# EAGLE design KeypadDisplay rev A (EAGLE 9.4.2)
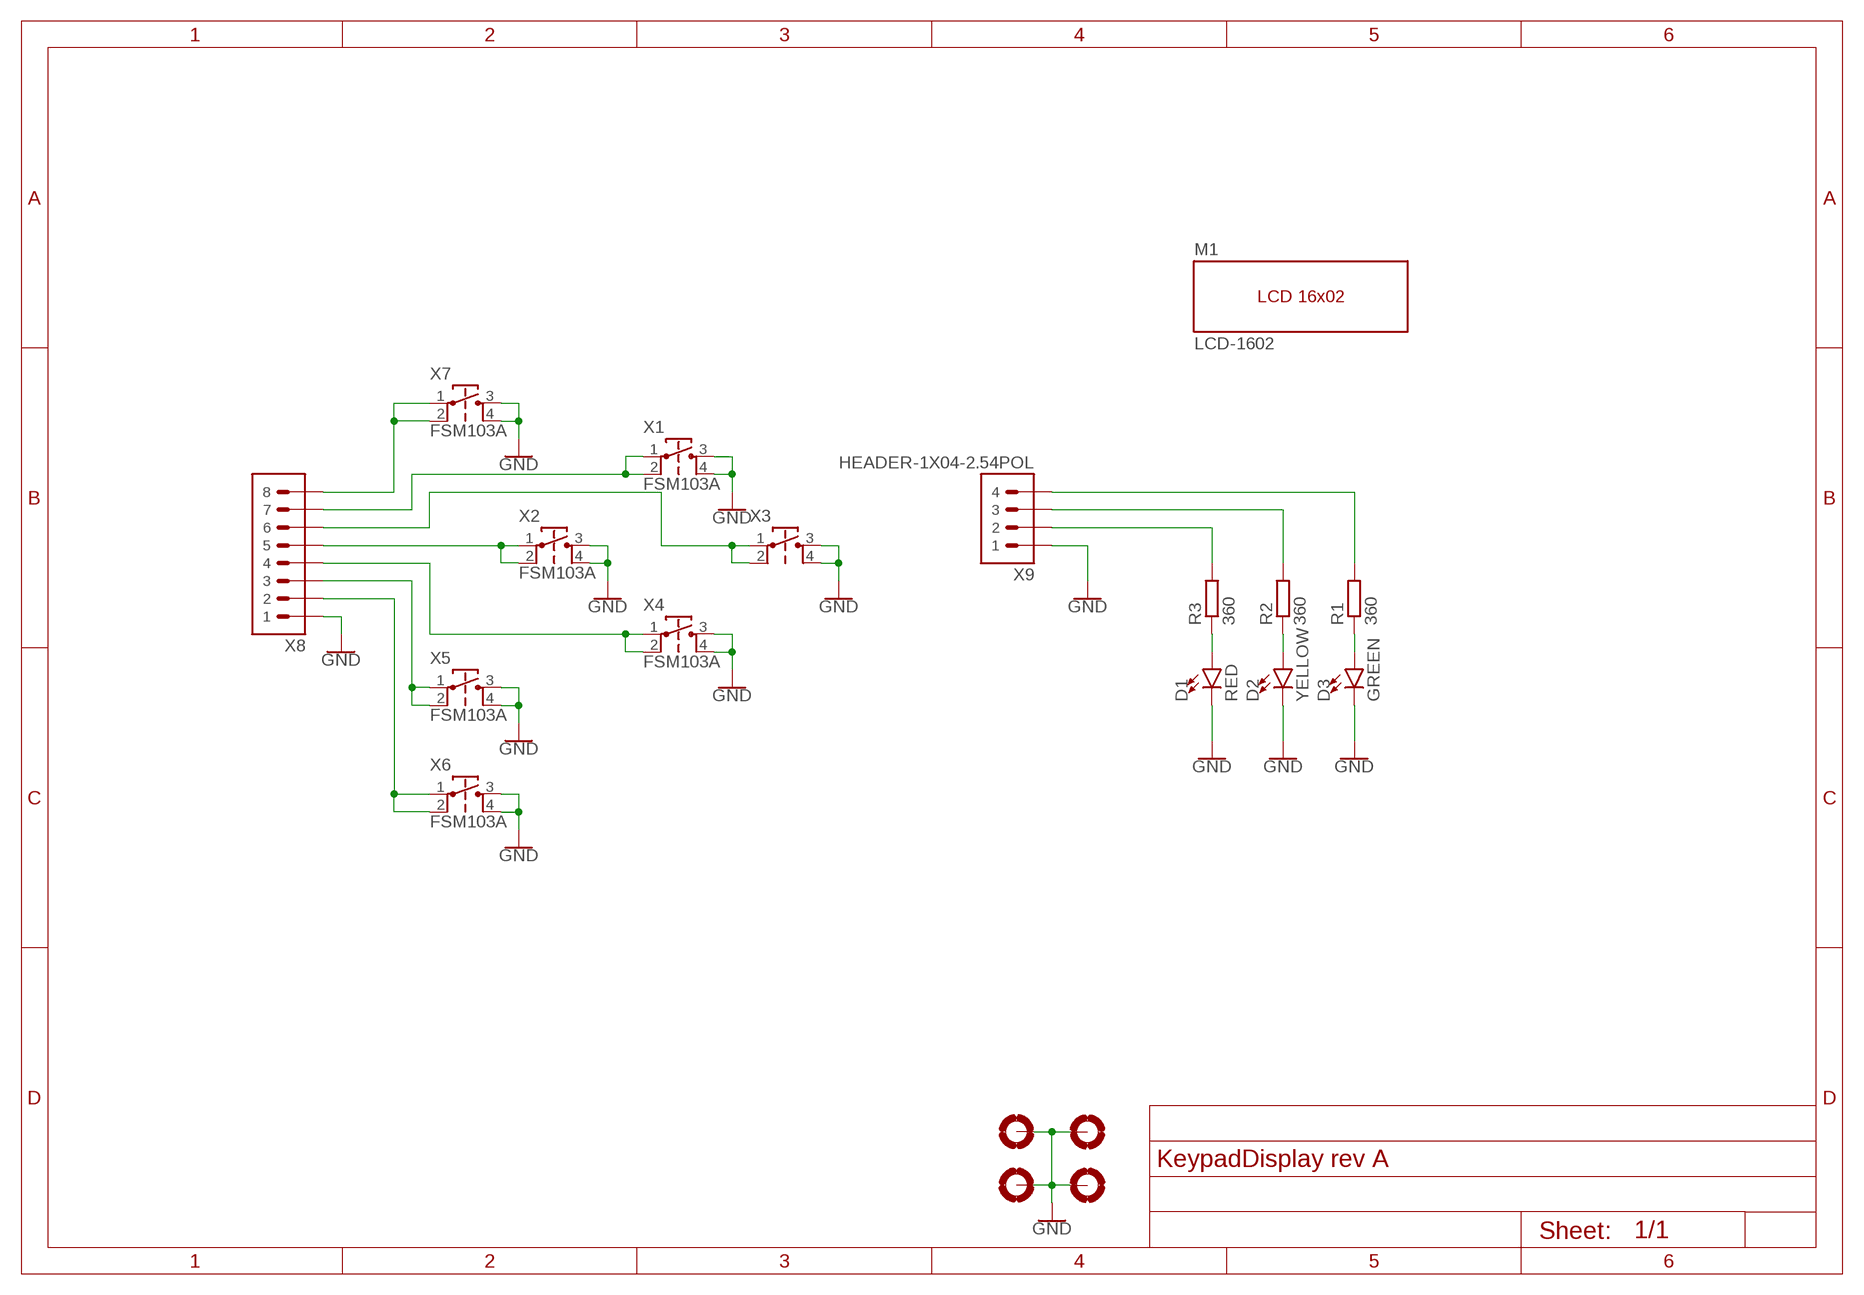
[diagram p0: schematic, sheet 1]

## Parts
D1  RED  LED5MM  [LED5MM]
D2  YELLOW  LED5MM  [LED5MM]
D3  GREEN  LED5MM  [LED5MM]
H1  MOUNTHOLE-PAD3.0  [3.0-PAD]
H2  MOUNTHOLE-PAD3.0  [3.0-PAD]
H3  MOUNTHOLE-PAD3.0  [3.0-PAD]
H4  MOUNTHOLE-PAD3.0  [3.0-PAD]
M1  LCD-1602  LCD-1602-NOHEADER  [LCD-1602-NOHEADER]
R1  360  R-EU_0204/7  [0204/7]
R2  360  R-EU_0204/7  [0204/7]
R3  360  R-EU_0204/7  [0204/7]
X1  FSM103A  TACT-SWITCHFSM103A  [TACT-SWITCH-FSM103A]
X2  FSM103A  TACT-SWITCHFSM103A  [TACT-SWITCH-FSM103A]
X3  TACT-SWITCHFSM103A  [TACT-SWITCH-FSM103A]
X4  FSM103A  TACT-SWITCHFSM103A  [TACT-SWITCH-FSM103A]
X5  FSM103A  TACT-SWITCHFSM103A  [TACT-SWITCH-FSM103A]
X6  FSM103A  TACT-SWITCHFSM103A  [TACT-SWITCH-FSM103A]
X7  FSM103A  TACT-SWITCHFSM103A  [TACT-SWITCH-FSM103A]
X8  HEADER-1X08-2.54POL  [1X08P-2.54]
X9  HEADER-1X04-2.54POL  [1X04P-2.54]

## Nets
GND: D1.K(C) D2.K(C) D3.K(C) H1.B3,2(MOUNT) H2.B3,2(MOUNT) H3.B3,2(MOUNT) H4.B3,2(MOUNT) X1.3(B) X1.4(B') X2.3(B) X2.4(B') X3.3(B) X3.4(B') X4.3(B) X4.4(B') X5.3(B) X5.4(B') X6.3(B) X6.4(B') X7.3(B) X7.4(B') X8.1 X9.1
N$1: X6.1(A) X6.2(A') X8.2
N$2: X4.1(A) X4.2(A') X8.4
N$3: X5.1(A) X5.2(A') X8.3
N$5: X2.1(A) X2.2(A') X8.5
N$6: R3.2 X9.2
N$7: X3.1(A) X3.2(A') X8.6
N$8: R2.2 X9.3
N$9: X1.1(A) X1.2(A') X8.7
N$10: R1.2 X9.4
N$11: X7.1(A) X7.2(A') X8.8
N$12: D1.A R3.1
N$13: D2.A R2.1
N$14: D3.A R1.1

## Library data of the parts
D1-D3 = M2M-LED:LED: LED (Generic) Standard schematic elements and footprints for 5mm, 3mm, 1206, and 0603 sized LEDs. Generic LEDs with no color specified.
H1-H4 = M2M-Holes:MOUNTHOLE-PAD
M1 = M2M-Modules:LCD-1602-NOHEADER
R1-R3 = rcl:R-EU_: RESISTOR, European symbol; SPICEPREFIX: R
X1-X7 = M2M-Switches:TACT-SWITCH
X8 = M2M-Connectors:HEADER-1X08-2.54
X9 = M2M-Connectors:HEADER-1X04-2.54

## Board
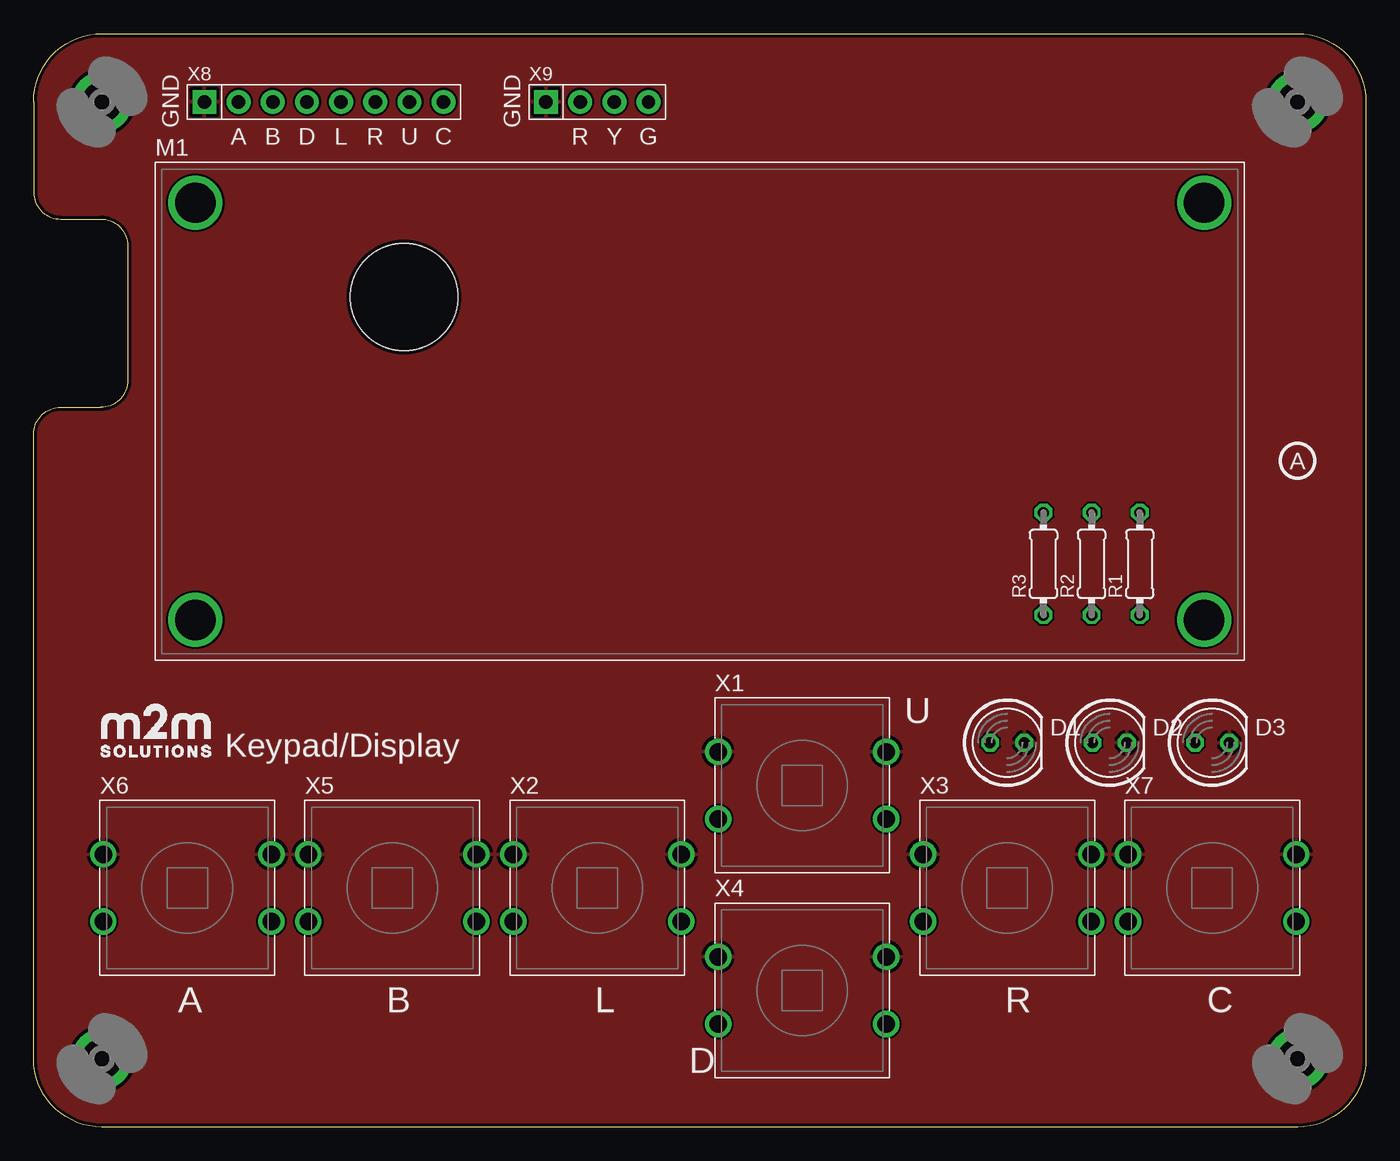
[diagram p1: board, top side]
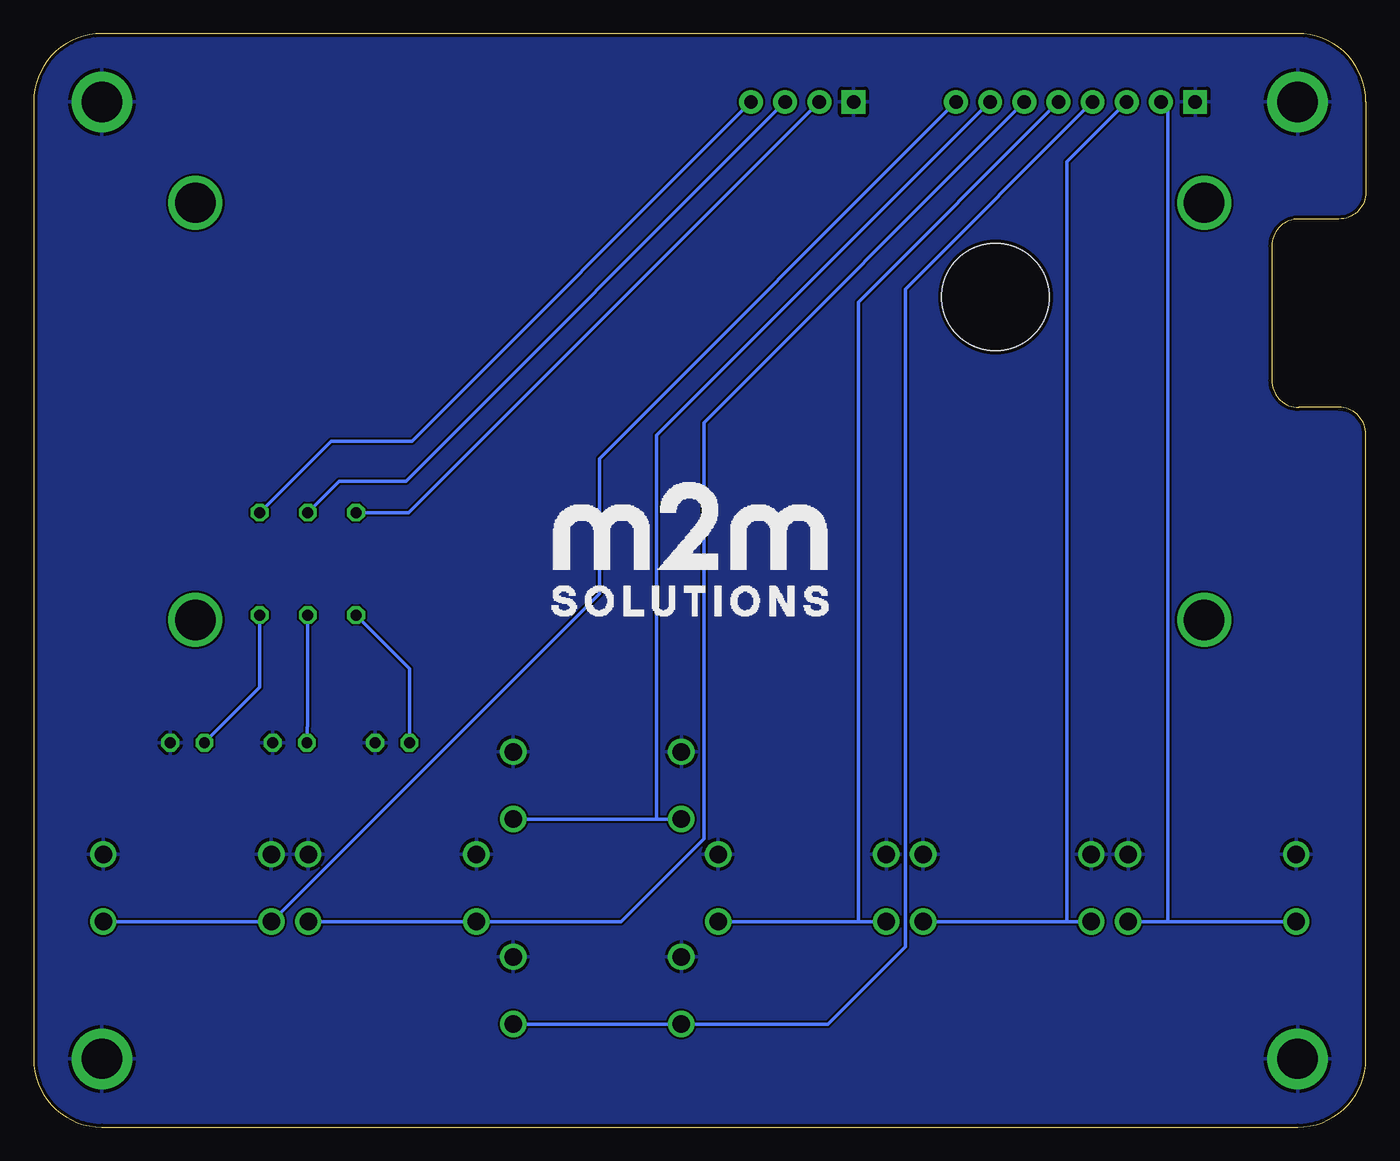
[diagram p2: board, bottom side, seen from below]

Size 99.06 x 81.28 mm. Coordinates in mm from the lower left corner, seen from the top.
Outline: 0,5.08 arc90 5.08,0 93.98,0 arc90 99.06,5.08 99.06,76.2 arc90 93.98,81.28 5.08,81.28 arc90 0,76.2 0,69.5 arc90 2,67.5 5,67.5 arc-90 7,65.5 7,55.5 arc-90 5,53.5 2,53.5 arc90 0,51.5 0,5
Copper layers (1*16): Top 0.035mm / dielectric 1.5mm / Bottom 0.035mm
Design rules "SeeedStudio_2layer_DRU_no_angle_20140221": minimum track width 6mil, minimum drill 12mil, track to track 6mil, track to pad 6mil, pad to pad 6mil, via to via 6mil, smd to smd 0mil, copper to edge 10mil, drill to drill 10mil, minimum pad ring 10mil, minimum via ring 6mil, stop-mask expansion 2mil, vias tented up to drill 100mil, thermal gap 10mil

### Footprints (pad centres in the part's own frame; a part is rotated, then mirrored left to right if it is on the bottom)
LED5MM = drill 0.813 octagon: A -1.27,0; K 1.27,0
3.0-PAD = drill 3 pad 4.5: B3,2 0,0
LCD-1602-NOHEADER = drill 3: P$1 -37.5,15.5; P$2 37.5,15.5; P$3 37.5,-15.5; P$4 -37.5,-15.5 | hole 8: -22,8.5
0204/7 = drill 0.813 octagon: 1 -3.81,0; 2 3.81,0
TACT-SWITCH-FSM103A = drill 1.3: 1 6.25,-2.5; 2 -6.25,-2.5; 3 6.25,2.5; 4 -6.25,2.5
1X08P-2.54 = drill 1 pad 1.778 square: 1 0,0 | drill 1 pad 1.778: 2 2.54,0; 3 5.08,0; 4 7.62,0; 5 10.16,0; 6 12.7,0; 7 15.24,0; 8 17.78,0
1X04P-2.54 = drill 1 pad 1.778 square: 1 0,0 | drill 1 pad 1.778: 2 2.54,0; 3 5.08,0; 4 7.62,0

### Placement (x,y rotation side)
D1  72.39,28.57 0 top
D2  80.01,28.57 0 top
D3  87.63,28.57 0 top
H1  5.08,5.08 0 top
H2  93.98,5.08 0 top
H3  5.08,76.2 0 top
H4  93.98,76.2 0 top
M1  49.53,53.2 0 top
R1  82.25,41.87 90 top
R2  78.67,41.87 90 top
R3  75.09,41.87 90 top
U$1  [M2M-10MMB]  40,38 0 top
U$2  [M2M-LOGO-4MM]  5,27.5 0 top
X1  57.15,25.4 0 top
X2  41.91,17.78 0 top
X3  72.39,17.78 0 top
X4  57.15,10.16 0 top
X5  26.67,17.78 0 top
X6  11.43,17.78 0 top
X7  87.63,17.78 0 top
X8  12.7,76.2 0 top
X9  38.1,76.2 0 top

### Tracks (layer width: path | path; a pad name or v marks a point on that pad's centre or on a via)
GND
  pour Top: 0,0 0,82.55 101.6,82.55 101.6,0
  pour Bottom: 0,0 0,82.55 99.06,82.55 99.06,0
N$1
  Bottom 0.254: X6.2 14.73,15.28 | 14.73,15.28 X6.1 | 14.73,15.28 14.73,75.69 X8.2
N$2
  Bottom 0.254: X4.2 52.5,7.66 | 52.5,7.66 X4.1 | X8.4 34.23,62.29 34.23,13.42 39.99,7.66 52.5,7.66
N$3
  Bottom 0.254: X5.2 22.23,15.28 | 22.23,15.28 X5.1 | X8.3 22.23,71.75 22.23,15.28
N$5
  Bottom 0.254: X2.2 37.73,15.28 | 37.73,15.28 X2.1 | X8.5 37.73,61.33 37.73,15.28
N$6
  Bottom 0.254: X9.2 71.16,45.68 R3.2
N$7
  Bottom 0.254: X3.2 66.23,15.28 | 66.23,15.28 X3.1 | X8.6 49.23,52.37 49.23,21.42 55.37,15.28 66.23,15.28
N$8
  Bottom 0.254: R2.2 76.35,48 71.38,48 X9.3
N$9
  Bottom 0.254: X1.2 52.73,22.9 | 52.73,22.9 X1.1 | X8.7 52.73,51.41 52.73,22.9
N$10
  Bottom 0.254: X9.4 70.92,51 76.93,51 R1.2
N$11
  Bottom 0.254: X7.1 X7.2 57,39.65 57,49.68 X8.8
N$12
  Bottom 0.254: D1.A 71.12,34.09 R3.1
N$13
  Bottom 0.254: D2.A 78.74,29.73 78.67,29.8 R2.1
N$14
  Bottom 0.254: D3.A 82.25,32.69 R1.1

### Text on the board
tPlace: GND | GND | A | B | D | L | R | U | C | R | Y | G | A | U | Keypad/Display | A | B | L | R | C | D